# EAGLE design Alim_1-Redressement_et_Filtrage (EAGLE 8.3.1)
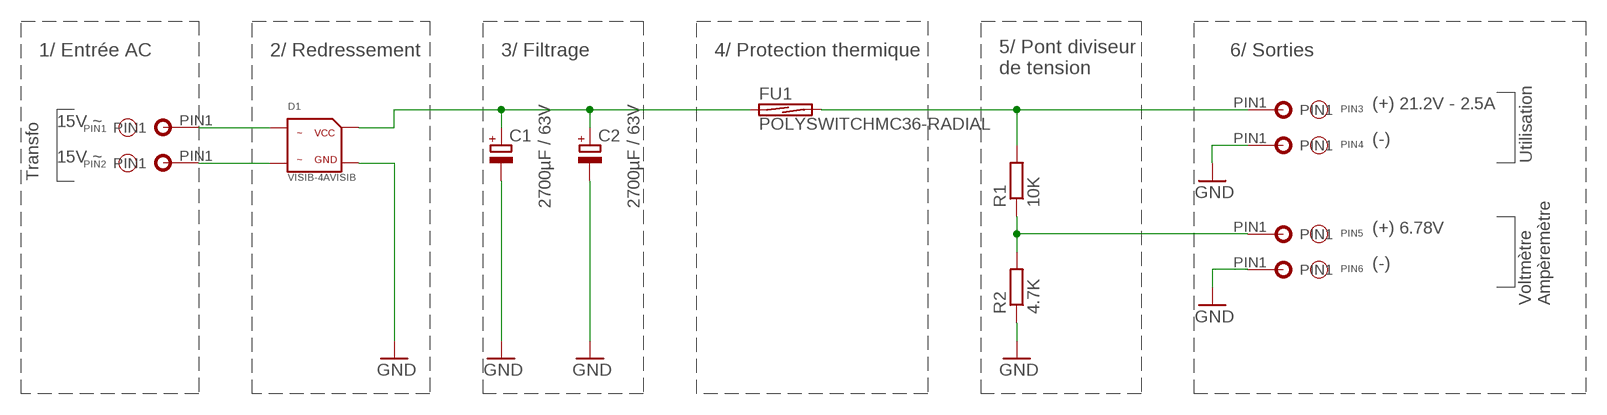
[diagram p0: schematic, sheet 1]

## Parts
C1  2700µF / 63V  CPOL-EUE10-25  [EB25D]
C2  2700µF / 63V  CPOL-EUE10-25  [EB25D]
D1  VISIB-4AVISIB  [VISIB-4A]
FU1  POLYSWITCHMC36-RADIAL  [MC36253-RADIAL]
PIN1  CON-FILTRAVERSANT-1FILTRAVERSANT-1  [CON-FILTRAVERSANT-1]
PIN2  CON-FILTRAVERSANT-1FILTRAVERSANT-1  [CON-FILTRAVERSANT-1]
PIN3  CON-FILTRAVERSANT-1FILTRAVERSANT-1  [CON-FILTRAVERSANT-1]
PIN4  CON-FILTRAVERSANT-1FILTRAVERSANT-1  [CON-FILTRAVERSANT-1]
PIN5  CON-FILTRAVERSANT-1FILTRAVERSANT-1  [CON-FILTRAVERSANT-1]
PIN6  CON-FILTRAVERSANT-1FILTRAVERSANT-1  [CON-FILTRAVERSANT-1]
R1  10K  R-EU_R0805  [R0805]
R2  4.7K  R-EU_R0805  [R0805]

## Nets
GND: C1.- C2.- D1.GND PIN4.PIN1 PIN6.PIN1 R2.1
N$1: D1.ALT1 PIN1.PIN1
N$2: D1.ALT2 PIN2.PIN1
N$3: C1.+ C2.+ D1.VCC FU1.1
N$4: PIN5.PIN1 R1.1 R2.2
N$5: FU1.2 PIN3.PIN1 R1.2

## Notes on the sheet
- 1/ Entrée AC | 2/ Redressement | 3/ Filtrage | 4/ Protection thermique | 6/ Sorties
- 5/ Pont diviseur
  de tension
- (+) 21.2V - 2.5A
- 15V ~
- (-)
- 15V ~ | Utilisation
- Transfo
- (+) 6.78V
- (-)
- Voltmètre
  Ampèremètre

## Library data of the parts
C1 C2 = rcl:CPOL-EU: POLARIZED CAPACITOR, European symbol
D1 = Alex-Diode-Redresseur:VISIB-4A
FU1 = Alex-Poly:POLYSWITCH
PIN1-PIN6 = Pin:CON-FILTRAVERSANT-1
R1 R2 = resistor:R-EU_: RESISTOR, European symbol

## Board
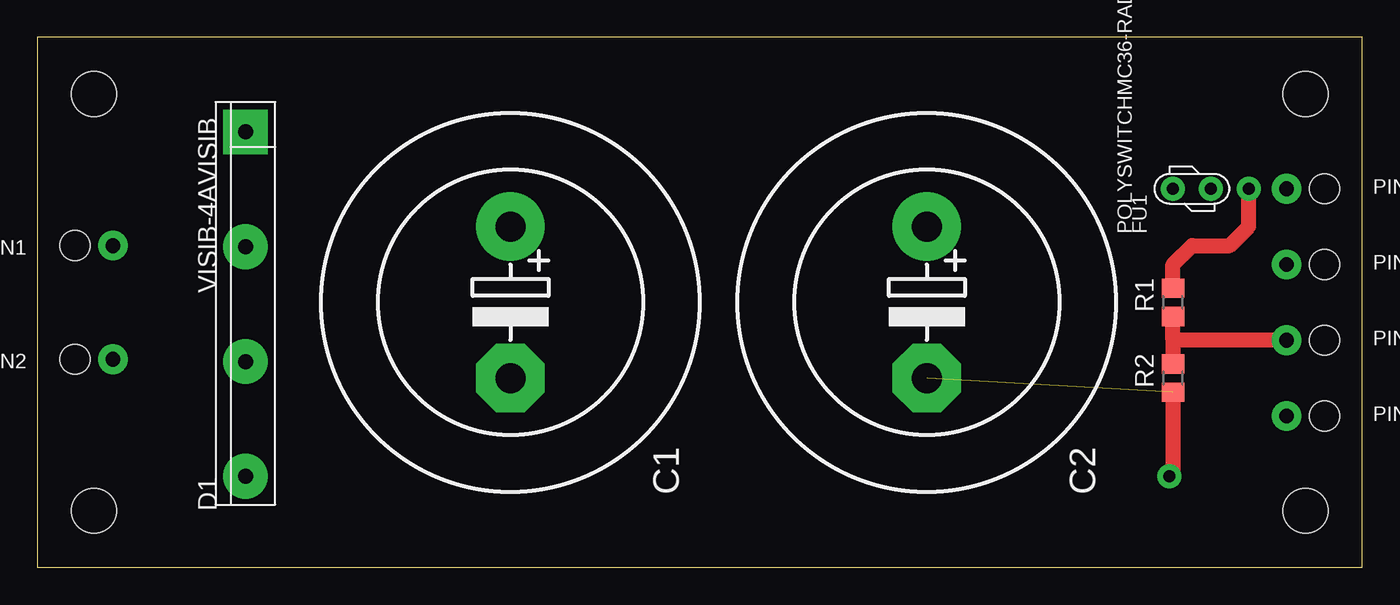
[diagram p1: board, top side]
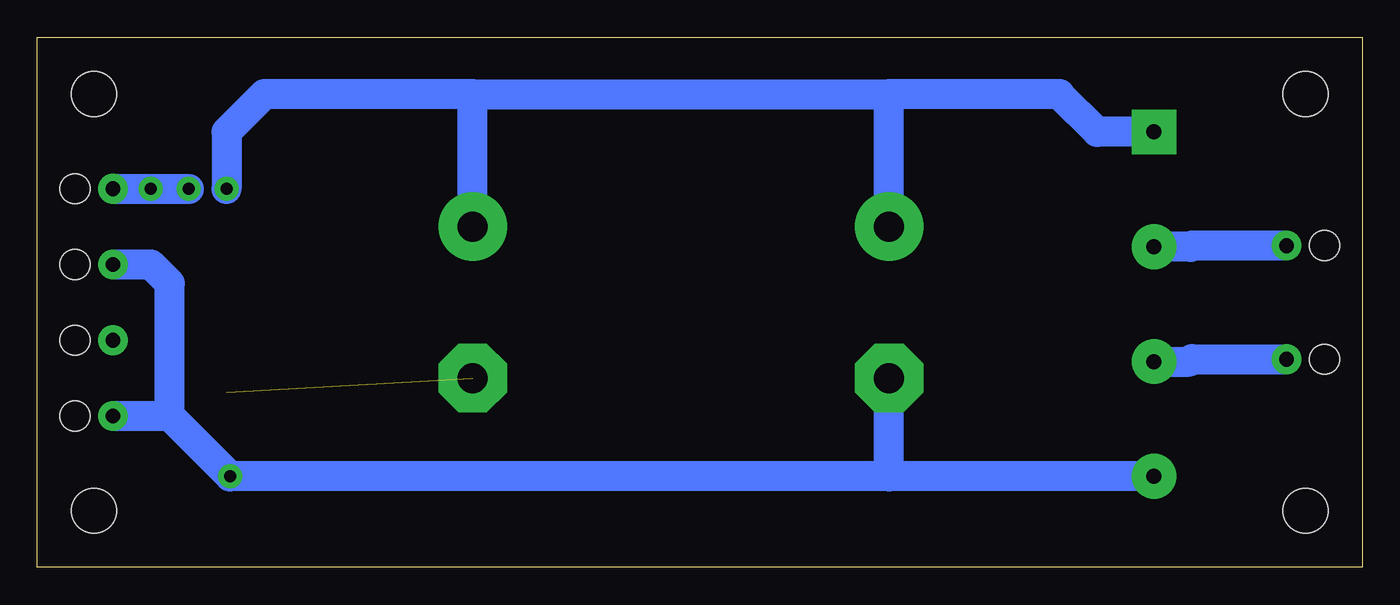
[diagram p2: board, bottom side, seen from below]

Size 88.9 x 35.56 mm. Coordinates in mm from the lower left corner, seen from the top.
Outline: 0,0 88.9,0 88.9,35.56 0,35.55 0,0
Copper layers (1*16): Top 0.035mm / dielectric 1.5mm / Bottom 0.035mm
Design rules "default": minimum track width 6mil, minimum drill 0.35mm, track to track 6mil, track to pad 6mil, pad to pad 6mil, via to via 6mil, smd to smd 6mil, copper to edge 40mil, drill to drill 6mil, minimum pad ring 10mil, minimum via ring 8mil, stop-mask expansion 4mil, vias tented up to drill 0mil, thermal gap 10mil
Holes 3 mm at 3.81,31.75 85.09,31.75 3.81,3.81 85.09,3.81

### Footprints (pad centres in the part's own frame; a part is rotated, then mirrored left to right if it is on the bottom)
EB25D = drill 2.007 pad 4.597: + -5.08,0 | drill 2.007 pad 4.597 octagon: - 5.08,0
VISIB-4A = drill 1 pad 3: ALT1 0,-7.7; ALT2 0,-15.4; GND 0,-23.1 | drill 1 pad 3 square: VCC 0,0
MC36253-RADIAL = drill 0.8 pad 1.6: 1 -1.27,0; 2 1.27,0
CON-FILTRAVERSANT-1 = drill 1 pad 2: PIN1 0,0 | hole 2: -2.54,0
R0805 = smd 1.3 x 1.5: 1 -0.95,0; 2 0.95,0

### Placement (x,y rotation side)
C1  31.75,17.78 270 top
C2  59.69,17.78 270 top
D1  13.97,29.21 0 top
FU1  77.47,25.4 0 top
PIN1  5.08,21.59 0 top
PIN2  5.08,13.97 0 top
PIN3  83.82,25.4 180 top
PIN4  83.82,20.32 180 top
PIN5  83.82,15.24 180 top
PIN6  83.82,10.16 180 top
R1  76.2,17.78 90 top
R2  76.2,12.7 90 top

### Tracks (layer width: path | path; a pad name or v marks a point on that pad's centre or on a via)
GND  (via drill 0.8 pad 1.6)  (1 unrouted)
  Top 1: R2.1 76.2,6.35 v75.96,6.11
  Bottom 2: D1.GND 31.75,6.11 | 31.75,6.11 v75.96,6.11 80.01,10.16 | PIN6.PIN1 80.01,10.16 | 31.75,6.11 C1.- | 80.01,10.16 80.01,19.05 81.28,20.32 PIN4.PIN1
N$1
  Bottom 2: 11.51,21.51 D1.ALT1 | 11.51,21.51 11.43,21.59 | PIN1.PIN1 11.43,21.59 | 11.43,21.59 11.51,21.51
N$2
  Bottom 2: D1.ALT2 11.59,13.81 11.43,13.97 PIN2.PIN1
N$3
  Bottom 2: C1.+ 31.75,31.75 | D1.VCC 17.78,29.21 20.32,31.75 31.75,31.75 | 59.69,31.75 31.75,31.75 | 59.69,31.75 73.66,31.75 76.2,29.21 FU1.1 | C2.+ 59.69,31.75
N$4
  Top 1: 76.2,15.28 R1.1 | 76.2,15.28 R2.2 | PIN5.PIN1 76.24,15.24 76.2,15.28
N$5  (via drill 0.8 pad 1.6)
  Top 1: R1.2 76.2,20.32 77.47,21.59 80.01,21.59 81.28,22.86 v81.28,25.4
  Bottom 2: PIN3.PIN1 v81.28,25.4 FU1.2